# Altium schematic sheet LP_ECG_Power-X01.SchDoc: DB POWER (part 1 of 3)
size Letter; Author: C. DEMOLDER; Engineer: C. DEMOLDER; Organization: GEORGIA TECH; Address1: NORTH AVE NW; Address2: ATLANTA, GA, 30332; DocumentNumber: P001; Revision: X01; SheetNumber: 3; SheetTotal: 4
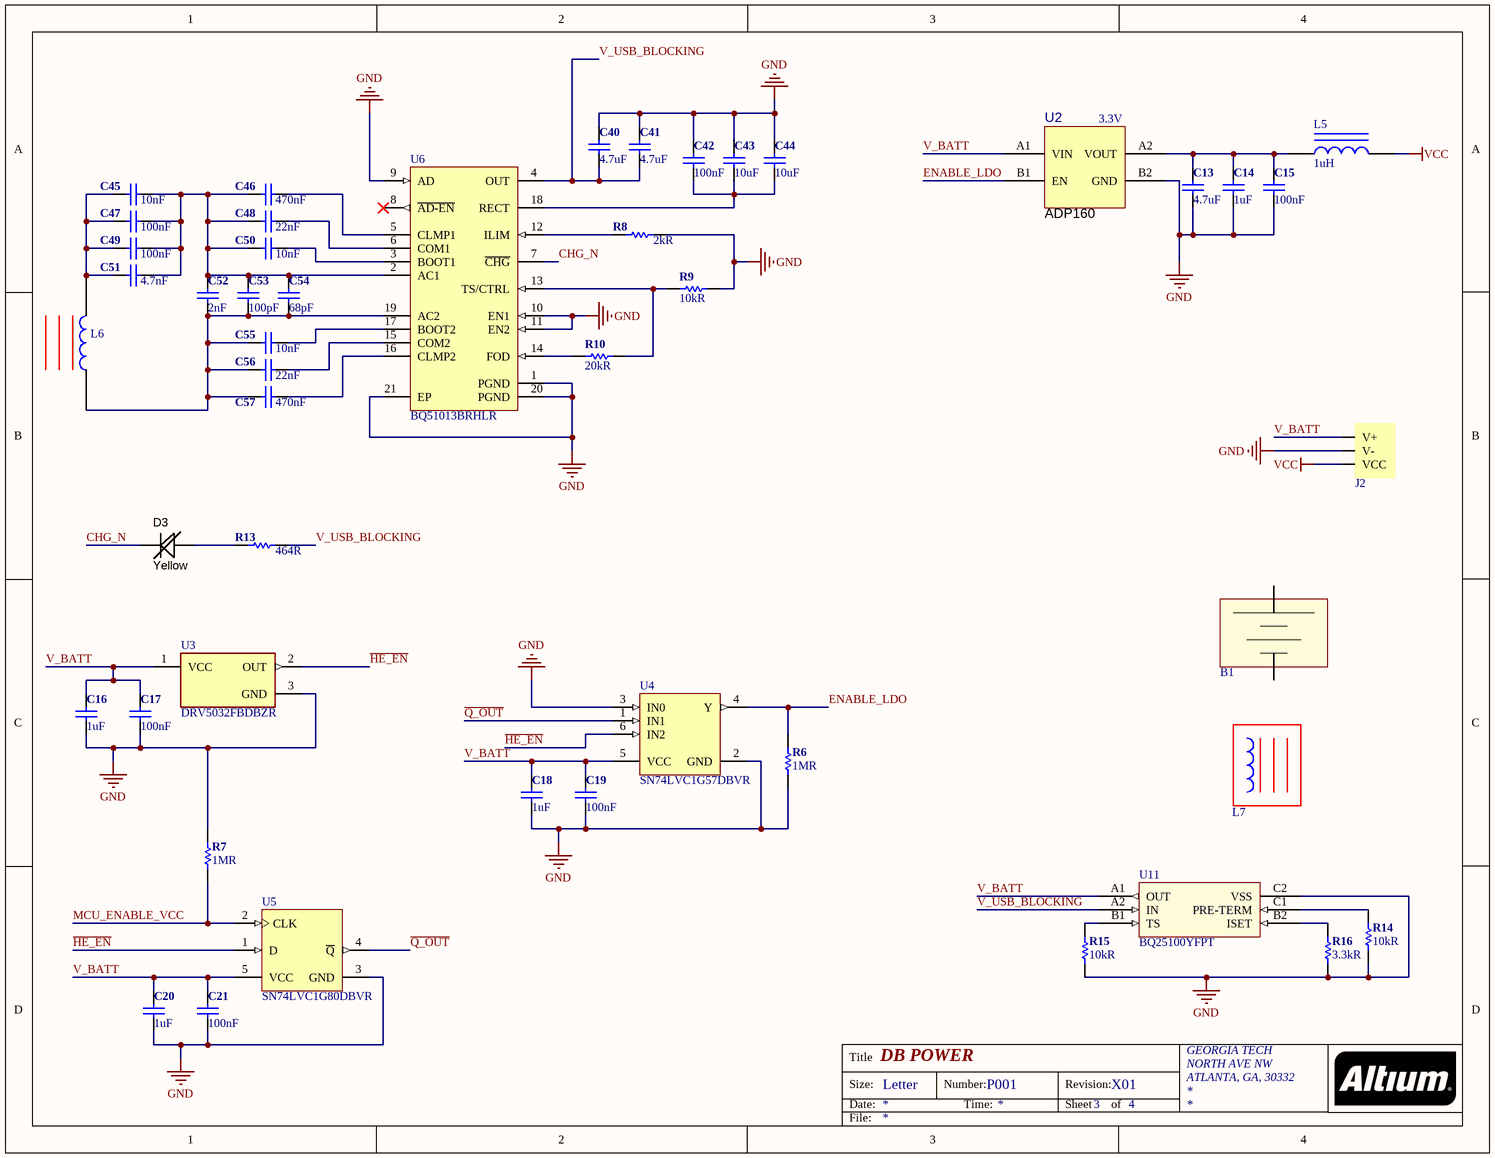
[diagram p0: LP_ECG_Power-X01.SchDoc]

## Parts
B1  40 mAh BATTERY  [BATTERY]  (value not drawn)
C13  4.7uF  [C0402]
C14  1uF  [C0402]
C15  100nF  [C0402]
C16  1uF  [C0402]
C17  100nF  [C0402]
C18  1uF  [C0402]
C19  100nF  [C0402]
C20  1uF  [C0402]
C21  100nF  [C0402]
C40  4.7uF  [C0402]
C41  4.7uF  [C0402]
C42  100nF  [C0402]
C43  10uF  [C0402]
C44  10uF  [C0402]
C45  10nF  [C0402]
C46  470nF  [C0402]
C47  100nF  [C0402]
C48  22nF  [C0402]
C49  100nF  [C0402]
C50  10nF  [C0402]
C51  4.7nF  [C0402]
C52  2nF  [C0402]
C53  100pF  [C0402]
C54  68pF  [C0402]
C55  10nF  [C0402]
C56  22nF  [C0402]
C57  470nF  [C0402]
D3  Yellow  [LED_0402]
J2  SMD CONNECTOR FOR 40 mAh BATTERY  [battery_connector]  (value not drawn)
L5  1uH  [L0402]
L6  WIRELESS CHARGING COIL, RECEIVER  [760308101219]  (value not drawn)
L7  WIRELESS CHARGING COIL, RECEIVER  [760308101219 - Physical Model]  (value not drawn)
R6  1MR  [R0402]
R7  1MR  [R0402]
R8  2kR  [R0402]
R9  10kR  [R0402]
R10  20kR  [R0402]
R13  464R  [R0402]
R14  10kR  [R0402]
R15  10kR  [R0402]
R16  3.3kR  [R0402]
U2  ADP160  Output Voltage: 3.3V  [ADP160]
U3  DRV5032FBDBZR  [FP-DBZ0003A-MFG]
U4  SN74LVC1G57DBVR  [DBV0006A_M]
U5  SN74LVC1G80DBVR  [DBV0005A_N]
U6  BQ51013BRHLR  [BQ51013BRHLR]
U11  BQ25100YFPT  [YZP0006]

## Nets
GND: C13.2 C14.2 C15.1 C16.2 C17.1 C18.2 C19.1 C20.2 C21.1 C40.1 C41.1 C42.1 C43.1 C44.1 J2.2(V-) R6.2 R7.1 R8.2 R9.2 R14.1 R15.1 R16.1 U2.B2(GND) U3.3(GND) U4.2(GND) U4.3(IN0) U5.3(GND) U6.1(PGND) U6.9(AD) U6.10(EN1) U6.11(EN2) U6.20(PGND) U6.21(EP) U11.C2(VSS)
VCC: J2.3(VCC) L5.2
~{HE_EN}: U3.2(OUT) U4.6(IN2) U5.1(D)
~{Q_OUT}: U4.1(IN1) U5.4(~{Q})
CHG_N: D3.K U6.7(~{CHG})
ENABLE_LDO: R6.1 U2.B1(EN) U4.4(Y)
MCU_ENABLE_VCC: R7.2 U5.2(CLK)
V_BATT: C16.1 C17.2 C18.1 C19.2 C20.1 C21.2 J2.1(V+) U2.A1(VIN) U3.1(VCC) U4.5(VCC) U5.5(VCC) U11.A1(OUT)
V_USB_BLOCKING: C40.2 C41.2 R13.2 U6.4(OUT) U11.A2(IN)
NetC13_1: C13.1 C14.1 C15.2 L5.1 U2.A2(VOUT)
NetC42_2: C42.2 C43.2 C44.2 U6.18(RECT)
NetC45_1: C45.1 C47.1 C49.1 C51.1 L6.2
NetC45_2: C45.2 C46.1 C47.2 C48.1 C49.2 C50.1 C51.2 C52.1 C53.1 C54.1 U6.2(AC1)
NetC46_2: C46.2 U6.5(CLMP1)
NetC48_2: C48.2 U6.6(COM1)
NetC50_2: C50.2 U6.3(BOOT1)
NetC52_2: C52.2 C53.2 C54.2 C55.1 C56.1 C57.1 L6.1 U6.19(AC2)
NetC55_2: C55.2 U6.17(BOOT2)
NetC56_2: C56.2 U6.15(COM2)
NetC57_2: C57.2 U6.16(CLMP2)
NetD3_A: D3.A R13.1
NetR8_1: R8.1 U6.12(ILIM)
NetR9_1: R9.1 R10.2 U6.13(TS/CTRL)
NetR10_1: R10.1 U6.14(FOD)
NetR14_2: R14.2 U11.C1(PRE-TERM)
NetR15_2: R15.2 U11.B1(TS)
NetR16_2: R16.2 U11.B2(ISET)

Not connected (* = marked no-connect by the designer): U6 8(~{AD-EN})*

## Notes on the sheet
- Title
- Size:
- Date:
- Letter
- Number:
- Time:
- Revision:
- Sheet
- of
- File: